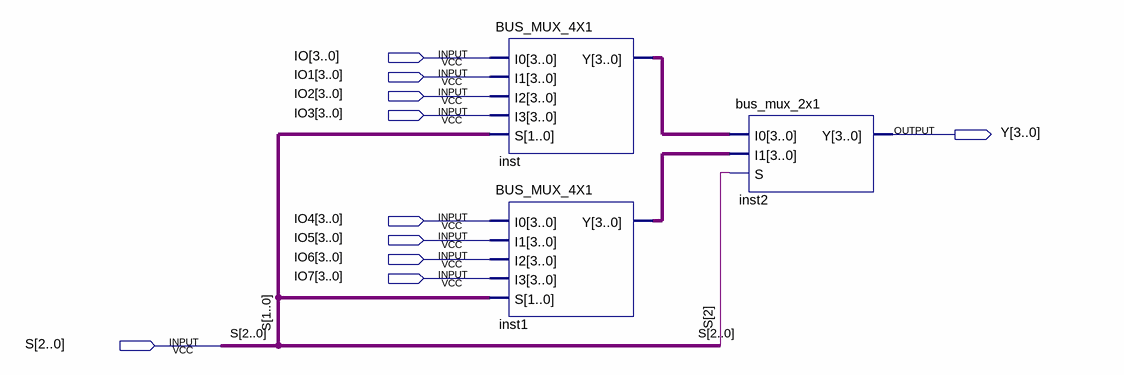
[diagram p0: schematic sheet]
// Quartus schematic BUS_MUX_8X1.bdf as structural Verilog: 3 symbols, 10 pins
module BUS_MUX_8X1 (
  input  [3:0] IO,
  input  [3:0] IO1,
  input  [3:0] IO2,
  input  [3:0] IO3,
  input  [3:0] IO4,
  input  [3:0] IO5,
  input  [3:0] IO6,
  input  [3:0] IO7,
  input  [2:0] S,
  output [3:0] Y
);

  wire [3:0] inst1_y, inst_y;

  BUS_MUX_4X1 inst (.I0(IO), .I1(IO1), .I2(IO2), .I3(IO3), .S(S[1:0]), .Y(inst_y));
  BUS_MUX_4X1 inst1 (.I0(IO4), .I1(IO5), .I2(IO6), .I3(IO7), .S(S[1:0]), .Y(inst1_y));
  bus_mux_2x1 inst2 (.I0(inst_y), .I1(inst1_y), .S(S[2]), .Y(Y));
endmodule
